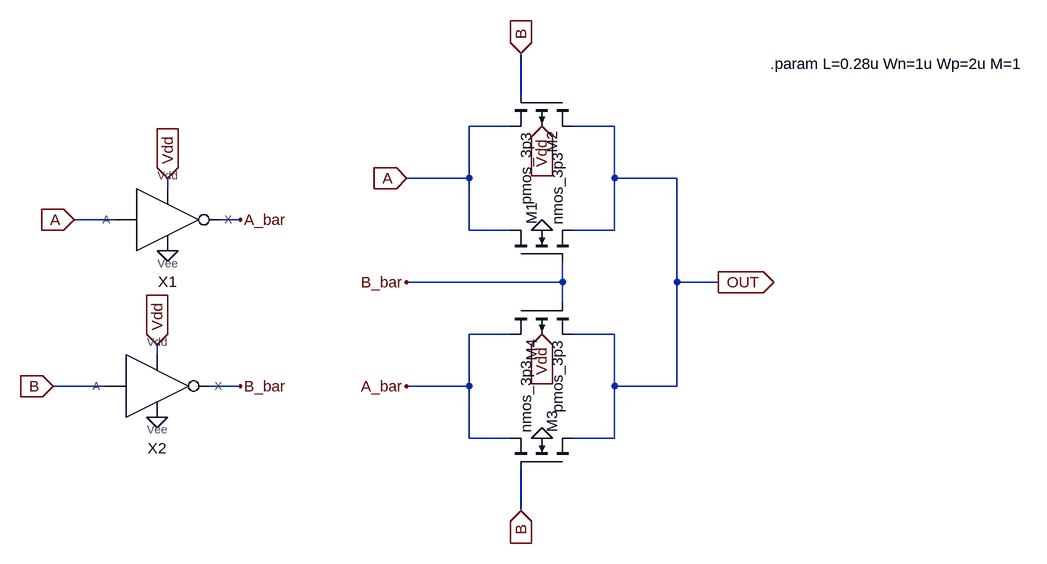
[diagram p0: schematic XORX1.asc]
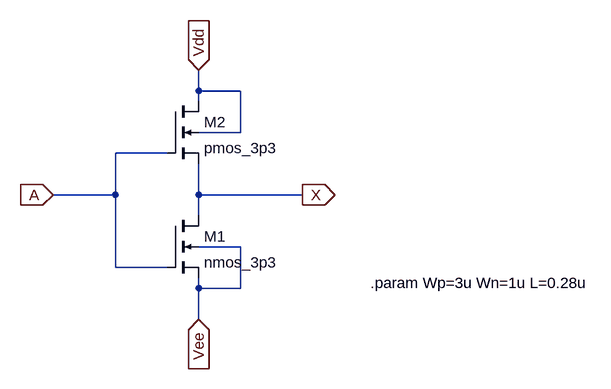
[diagram p1: sub-circuit invx1.asc]
XORX1.asc, the LTspice schematic file:
Version 4
SHEET 1 880 680
WIRE 0 -64 0 -128
WIRE -16 -16 -80 -16
WIRE 144 -16 80 -16
WIRE -80 64 -80 -16
WIRE -80 64 -176 64
WIRE 144 64 144 -16
WIRE 240 64 144 64
WIRE -544 80 -544 64
WIRE -624 128 -688 128
WIRE -432 128 -464 128
WIRE -80 144 -80 64
WIRE -16 144 -80 144
WIRE 144 144 144 64
WIRE 144 144 80 144
WIRE 64 224 64 192
WIRE 64 224 -176 224
WIRE 240 224 240 64
WIRE 304 224 240 224
WIRE 64 256 64 224
WIRE -16 304 -80 304
WIRE 144 304 80 304
WIRE -560 336 -560 320
WIRE -640 384 -720 384
WIRE -432 384 -480 384
WIRE -80 384 -80 304
WIRE -80 384 -176 384
WIRE 144 384 144 304
WIRE 240 384 240 224
WIRE 240 384 144 384
WIRE -80 464 -80 384
WIRE -16 464 -80 464
WIRE 144 464 144 384
WIRE 144 464 80 464
WIRE 0 576 0 512
FLAG 32 144 0
FLAG 32 -16 Vdd
IOPIN 32 -16 In
FLAG 32 464 0
FLAG 32 304 Vdd
IOPIN 32 304 In
FLAG 0 576 B
IOPIN 0 576 In
FLAG 0 -128 B
IOPIN 0 -128 In
FLAG 304 224 OUT
IOPIN 304 224 Out
FLAG -544 176 0
FLAG -560 432 0
FLAG -544 64 Vdd
IOPIN -544 64 In
FLAG -560 320 Vdd
IOPIN -560 320 In
FLAG -720 384 B
IOPIN -720 384 In
FLAG -688 128 A
IOPIN -688 128 In
FLAG -432 128 A_bar
FLAG -432 384 B_bar
FLAG -176 384 A_bar
FLAG -176 224 B_bar
FLAG -176 64 A
IOPIN -176 64 In
SYMBOL nmos4 -16 192 R270
SYMATTR InstName M1
SYMATTR Value nmos_3p3
SYMATTR Value2 l='L' w='Wn' m='M'
SYMBOL pmos4 80 -64 R90
SYMATTR InstName M2
SYMATTR Value pmos_3p3
SYMATTR Value2 l='L' w='Wp' m='M'
SYMBOL nmos4 80 512 M270
SYMATTR InstName M3
SYMATTR Value nmos_3p3
SYMATTR Value2 l='L' w='Wn' m='M'
SYMBOL pmos4 -16 256 M90
SYMATTR InstName M4
SYMATTR Value pmos_3p3
SYMATTR Value2 l='L' w='Wp' m='M'
SYMBOL INVx1 -544 128 R0
SYMATTR InstName X1
SYMBOL INVx1 -560 384 R0
SYMATTR InstName X2
TEXT 384 -112 Left 2 !.param L=0.28u Wn=1u Wp=2u M=1

invx1.asc, the sub-circuit schematic file:
Version 4
SHEET 1 2776 836
WIRE 416 -16 416 -48
WIRE 480 -16 416 -16
WIRE 416 0 416 -16
WIRE 480 48 480 -16
WIRE 480 48 416 48
WIRE 368 80 288 80
WIRE 288 144 288 80
WIRE 288 144 192 144
WIRE 416 144 416 96
WIRE 576 144 416 144
WIRE 416 176 416 144
WIRE 480 224 416 224
WIRE 288 256 288 144
WIRE 368 256 288 256
WIRE 416 288 416 272
WIRE 480 288 480 224
WIRE 480 288 416 288
WIRE 416 336 416 288
FLAG 416 -48 Vdd
IOPIN 416 -48 In
FLAG 192 144 A
IOPIN 192 144 In
FLAG 576 144 X
IOPIN 576 144 Out
FLAG 416 336 Vee
IOPIN 416 336 In
SYMBOL nmos4 368 176 R0
SYMATTR InstName M1
SYMATTR Value nmos_3p3
SYMATTR Value2 l={L} w={Wn}
SYMBOL nmos4 368 0 R0
SYMATTR InstName M2
SYMATTR Value pmos_3p3
SYMATTR Value2 l={L} w={Wp}
TEXT 680 280 Left 2 !.param Wp=3u Wn=1u L=0.28u

The netlist it stands for:
* XORX1.asc
M1 A B_bar OUT 0 nmos_3p3 l='L' w='Wn' m='M'
M2 OUT B A Vdd pmos_3p3 l='L' w='Wp' m='M'
M3 OUT B A_bar 0 nmos_3p3 l='L' w='Wn' m='M'
M4 A_bar B_bar OUT Vdd pmos_3p3 l='L' w='Wp' m='M'
XX1 A Vdd A_bar 0 invx1
XX2 B Vdd B_bar 0 invx1

* block symbol definitions
.subckt invx1 A Vdd X Vee
M1 X A Vee Vee nmos_3p3 l={L} w={Wn}
M2 Vdd A X Vdd pmos_3p3 l={L} w={Wp}
.param Wp=3u Wn=1u L=0.28u
.ends invx1

.model NMOS NMOS
.model PMOS PMOS
.lib standard.mos
.param L=0.28u Wn=1u Wp=2u M=1
.backanno
.end